# Altium schematic sheet Board AB Thumb.SchDoc
size A3
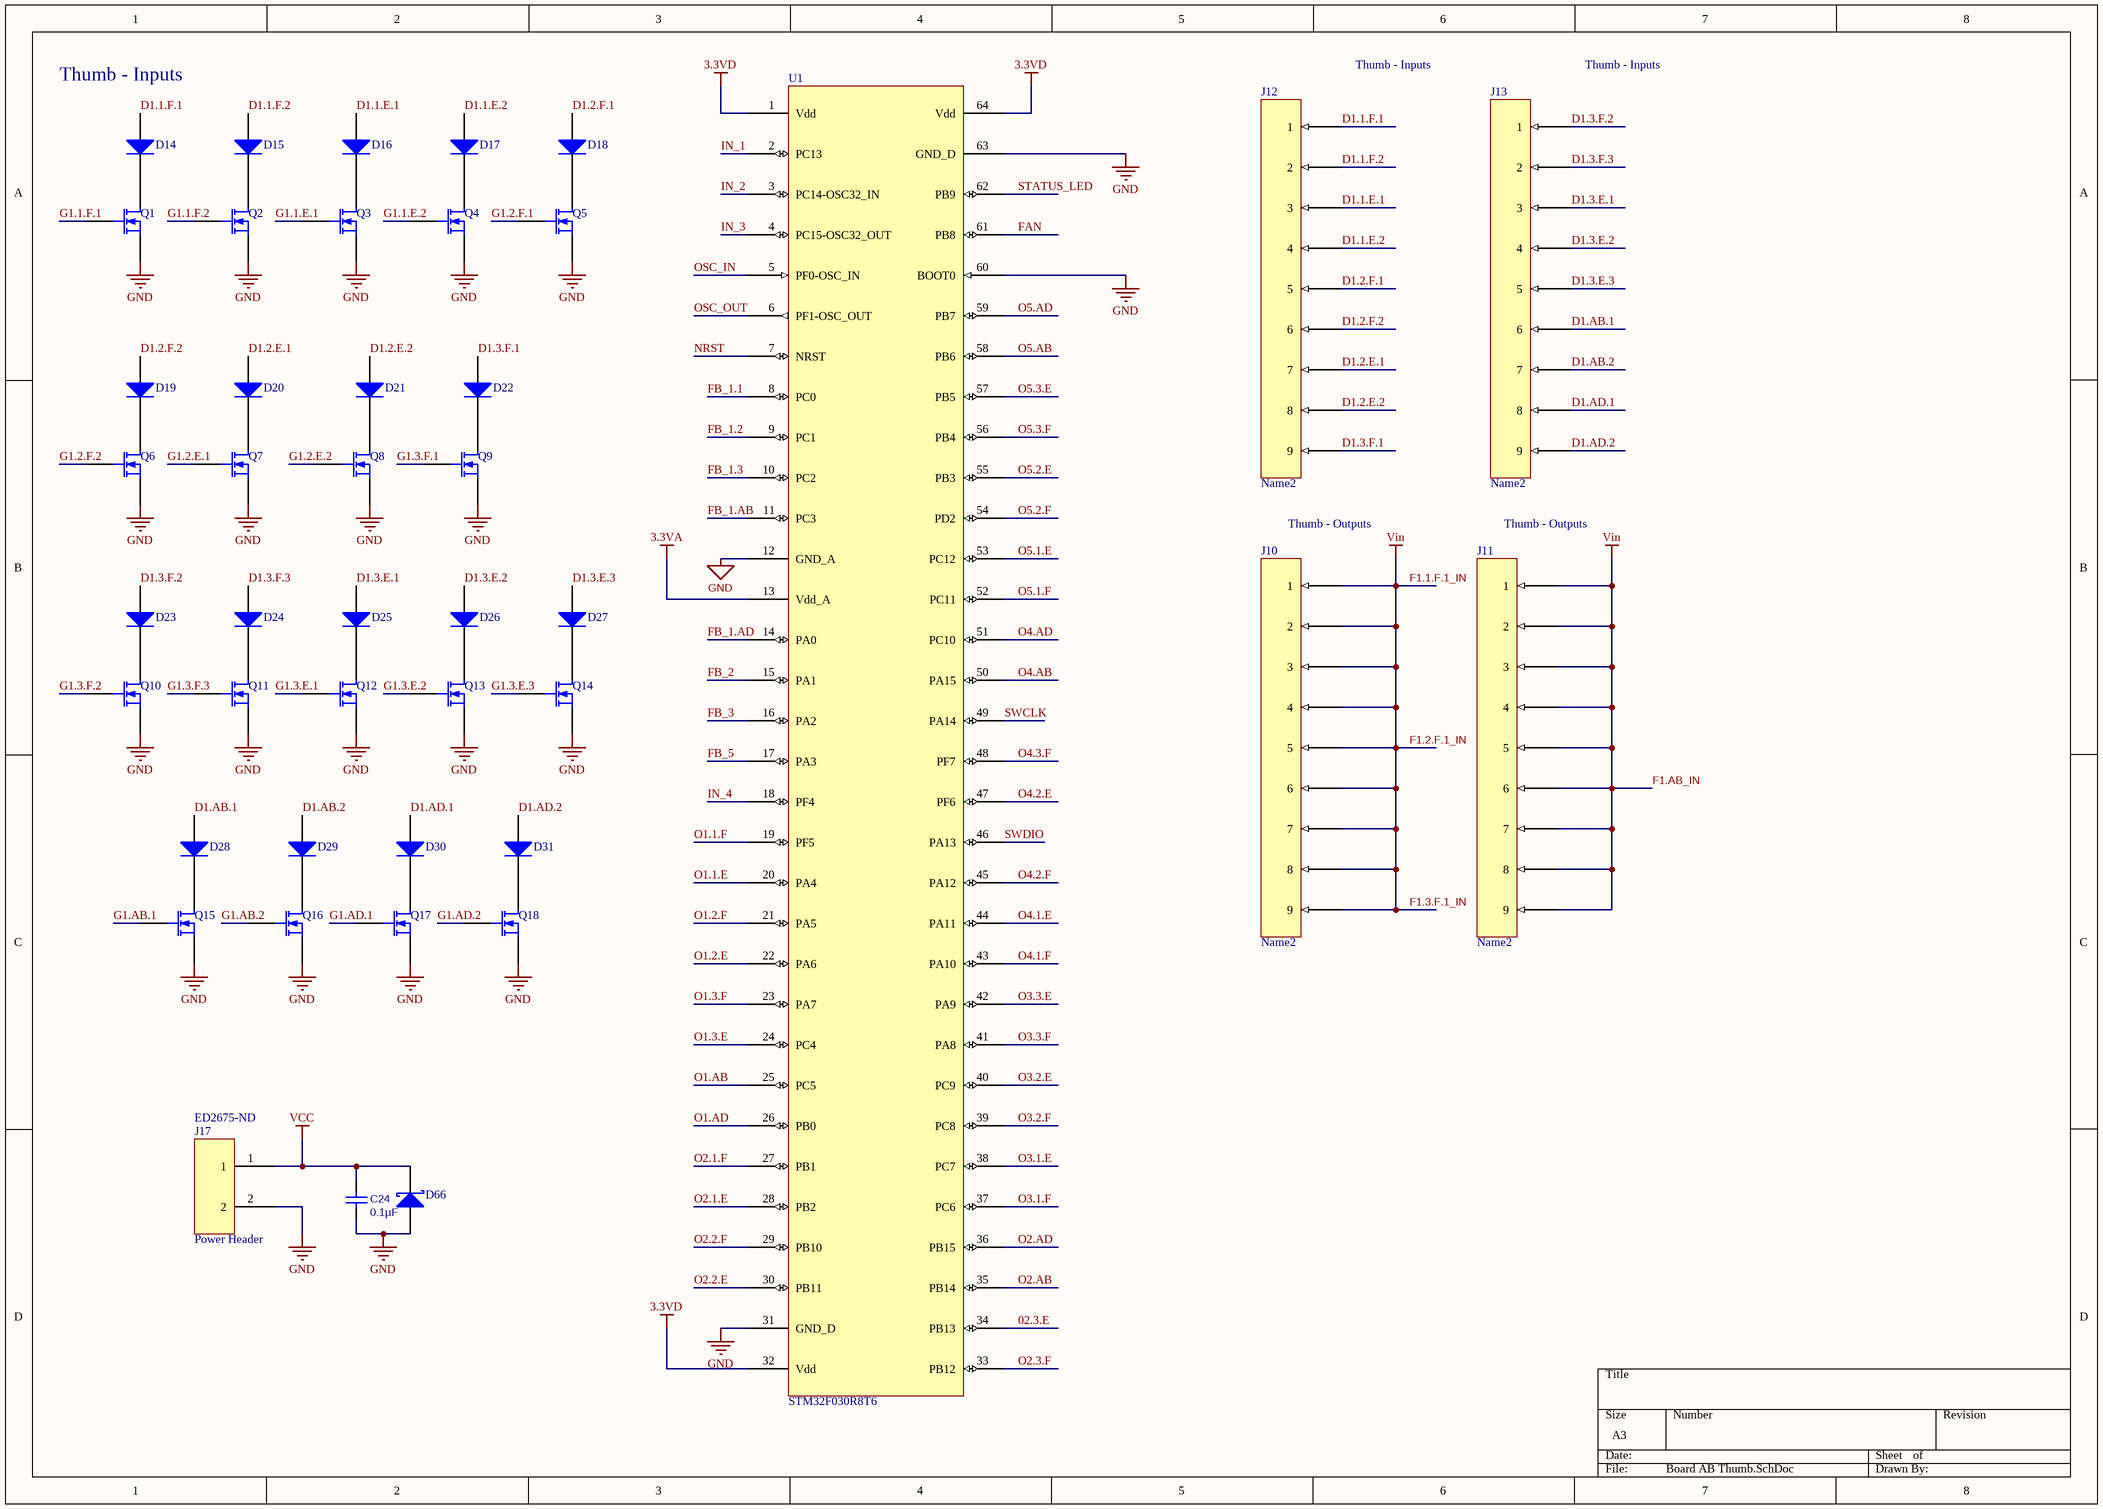
[diagram p0: Board AB Thumb.SchDoc]

## Parts
C24  value 0.1µF  [TDK C-Series (1608)]
D14  de  [SMC]  (value not drawn)
D15  de  [SMC]  (value not drawn)
D16  de  [SMC]  (value not drawn)
D17  de  [SMC]  (value not drawn)
D18  de  [SMC]  (value not drawn)
D19  de  [SMC]  (value not drawn)
D20  de  [SMC]  (value not drawn)
D21  de  [SMC]  (value not drawn)
D22  de  [SMC]  (value not drawn)
D23  de  [SMC]  (value not drawn)
D24  de  [SMC]  (value not drawn)
D25  de  [SMC]  (value not drawn)
D26  de  [SMC]  (value not drawn)
D27  de  [SMC]  (value not drawn)
D28  de  [SMC]  (value not drawn)
D29  de  [SMC]  (value not drawn)
D30  de  [SMC]  (value not drawn)
D31  de  [SMC]  (value not drawn)
D66  Diode BAT17  [SOT-23_N]  (value not drawn)
J10  Name2
J11  Name2
J12  Name2
J13  Name2
J17  Power Header  Supplier Part Number 1: ED2675-ND
Q1  (no value)
Q2  (no value)
Q3  (no value)
Q4  (no value)
Q5  (no value)
Q6  (no value)
Q7  (no value)
Q8  (no value)
Q9  (no value)
Q10  (no value)
Q11  (no value)
Q12  (no value)
Q13  (no value)
Q14  (no value)
Q15  (no value)
Q16  (no value)
Q17  (no value)
Q18  (no value)
U1  STM32F030R8T6

## Nets
3.3VA: U1.13(Vdd_A)
3.3VD: U1.1(Vdd) U1.32(Vdd) U1.64(Vdd)
F1.1.F.1_IN: J10.1 J10.3 J10.4 J10.5 J10.6 J10.7 J10.8 J10.9 J10.66(2) J11.1 J11.3 J11.4 J11.5 J11.6 J11.7 J11.8 J11.9 J11.66(2)  [also labelled F1.2.F.1_IN, F1.3.F.1_IN, F1.AB_IN, Vin]
GND: C24.1 D66.1(A) J17.2 Q1.3(S) Q2.3(S) Q3.3(S) Q4.3(S) Q5.3(S) Q6.3(S) Q7.3(S) Q8.3(S) Q9.3(S) Q10.3(S) Q11.3(S) Q12.3(S) Q13.3(S) Q14.3(S) Q15.3(S) Q16.3(S) Q17.3(S) Q18.3(S) U1.12(GND_A) U1.31(GND_D) U1.60(BOOT0) U1.63(GND_D)
VCC: C24.2 D66.3(K) J17.1
02.3.E: U1.34(PB13)
D1.1.E.1: D16.1(A) J12.3
D1.1.E.2: D17.1(A) J12.4
D1.1.F.1: D14.1(A) J12.1
D1.1.F.2: D15.1(A) J12.66(2)
D1.2.E.1: D20.1(A) J12.7
D1.2.E.2: D21.1(A) J12.8
D1.2.F.1: D18.1(A) J12.5
D1.2.F.2: D19.1(A) J12.6
D1.3.E.1: D25.1(A) J13.3
D1.3.E.2: D26.1(A) J13.4
D1.3.E.3: D27.1(A) J13.5
D1.3.F.1: D22.1(A) J12.9
D1.3.F.2: D23.1(A) J13.1
D1.3.F.3: D24.1(A) J13.66(2)
D1.AB.1: D28.1(A) J13.6
D1.AB.2: D29.1(A) J13.7
D1.AD.1: D30.1(A) J13.8
D1.AD.2: D31.1(A) J13.9
FAN: U1.61(PB8)
FB_1.1: U1.8(PC0)
FB_1.2: U1.9(PC1)
FB_1.3: U1.10(PC2)
FB_1.AB: U1.11(PC3)
FB_1.AD: U1.14(PA0)
FB_2: U1.15(PA1)
FB_3: U1.16(PA2)
FB_5: U1.17(PA3)
G1.1.E.1: Q3.2(G)
G1.1.E.2: Q4.2(G)
G1.1.F.1: Q1.2(G)
G1.1.F.2: Q2.2(G)
G1.2.E.1: Q7.2(G)
G1.2.E.2: Q8.2(G)
G1.2.F.1: Q5.2(G)
G1.2.F.2: Q6.2(G)
G1.3.E.1: Q12.2(G)
G1.3.E.2: Q13.2(G)
G1.3.E.3: Q14.2(G)
G1.3.F.1: Q9.2(G)
G1.3.F.2: Q10.2(G)
G1.3.F.3: Q11.2(G)
G1.AB.1: Q15.2(G)
G1.AB.2: Q16.2(G)
G1.AD.1: Q17.2(G)
G1.AD.2: Q18.2(G)
IN_1: U1.2(PC13)
IN_2: U1.3(PC14-OSC32_IN)
IN_3: U1.4(PC15-OSC32_OUT)
IN_4: U1.18(PF4)
NRST: U1.7(NRST)
O1.1.E: U1.20(PA4)
O1.1.F: U1.19(PF5)
O1.2.E: U1.22(PA6)
O1.2.F: U1.21(PA5)
O1.3.E: U1.24(PC4)
O1.3.F: U1.23(PA7)
O1.AB: U1.25(PC5)
O1.AD: U1.26(PB0)
O2.1.E: U1.28(PB2)
O2.1.F: U1.27(PB1)
O2.2.E: U1.30(PB11)
O2.2.F: U1.29(PB10)
O2.3.F: U1.33(PB12)
O2.AB: U1.35(PB14)
O2.AD: U1.36(PB15)
O3.1.E: U1.38(PC7)
O3.1.F: U1.37(PC6)
O3.2.E: U1.40(PC9)
O3.2.F: U1.39(PC8)
O3.3.E: U1.42(PA9)
O3.3.F: U1.41(PA8)
O4.1.E: U1.44(PA11)
O4.1.F: U1.43(PA10)
O4.2.E: U1.47(PF6)
O4.2.F: U1.45(PA12)
O4.3.F: U1.48(PF7)
O4.AB: U1.50(PA15)
O4.AD: U1.51(PC10)
O5.1.E: U1.53(PC12)
O5.1.F: U1.52(PC11)
O5.2.E: U1.55(PB3)
O5.2.F: U1.54(PD2)
O5.3.E: U1.57(PB5)
O5.3.F: U1.56(PB4)
O5.AB: U1.58(PB6)
O5.AD: U1.59(PB7)
OSC_IN: U1.5(PF0-OSC_IN)
OSC_OUT: U1.6(PF1-OSC_OUT)
STATUS_LED: U1.62(PB9)
SWCLK: U1.49(PA14)
SWDIO: U1.46(PA13)
NetD14_2: D14.2(K) Q1.1(D)
NetD15_2: D15.2(K) Q2.1(D)
NetD16_2: D16.2(K) Q3.1(D)
NetD17_2: D17.2(K) Q4.1(D)
NetD18_2: D18.2(K) Q5.1(D)
NetD19_2: D19.2(K) Q6.1(D)
NetD20_2: D20.2(K) Q7.1(D)
NetD21_2: D21.2(K) Q8.1(D)
NetD22_2: D22.2(K) Q9.1(D)
NetD23_2: D23.2(K) Q10.1(D)
NetD24_2: D24.2(K) Q11.1(D)
NetD25_2: D25.2(K) Q12.1(D)
NetD26_2: D26.2(K) Q13.1(D)
NetD27_2: D27.2(K) Q14.1(D)
NetD28_2: D28.2(K) Q15.1(D)
NetD29_2: D29.2(K) Q16.1(D)
NetD30_2: D30.2(K) Q17.1(D)
NetD31_2: D31.2(K) Q18.1(D)

## Notes on the sheet
- Thumb - Inputs
- Thumb - Outputs

## Library data of the parts
C24 = Cap: Capacitor; Published: 8-Jun-2000; LatestRevisionDate: 17-Jul-2002; LatestRevisionNote: Re-released for DXP Platform.; PackageReference: RAD-0.3; Publisher: Altium Limited; PackageDescription: Radial Cap, Thru-Hole; 2 Leads; 0.3 in Pin Spacing; Supplier 1: Digi-Key; Supplier Part Number 1: 445-1316-1-ND
D14-D31 = Diode: Default Diode; Published: 8-Jun-2000; LatestRevisionDate: 17-Jul-2002; LatestRevisionNote: Re-released for DXP Platform.; PackageVersion: Sep-1996; PackageReference: SMC; Publisher: Altium Limited; PackageDescription: DO-214-AB/SMC; 2 C-Bend Leads; Body 7.9 x 5.9 mm, inc. leads (LxW); Code_JEDEC: DO-214-AB; Supplier 1: Digi-Key; Supplier Part Number 1: 1727-5384-1-ND
D66 = Diode BAT17: Silicon RF Schottky Diode for Mixer Applications in the VHF/UHF Range; Note: Pin 2 is not connected and not drawn.; Published: 21-Mar-2003; LatestRevisionDate: 29-May-2009; LatestRevisionNote: IPC-7351 Footprint Added.; DatasheetVersion: Oct-1999; PackageVersion: Sep-2001; PackageReference: SOT-23; Publisher: Altium Limited; PackageDescription: 3-Pin SOT-23 Package 0.95 mm Pitch, 2.5 mm Lead Span; ComponentLink1Description: Manufacturer Link; ComponentLink1URL: http://www.infineon.com/; ComponentLink2Description: Datasheet; ComponentLink2URL: http://www.infineon.com/upload/Document/cmc_upload/documents/009/363/bat17series.pdf; Supplier 1: Digi-Key; Supplier Part Number 1: DF2S10FSL3MCT-ND
J10-J13 = Name2: 9 Position header
Q1-Q18 = MOSFET-N: N-Channel MOSFET; Published: 8-Jun-2000; LatestRevisionDate: 17-Jul-2002; LatestRevisionNote: Re-released for DXP Platform.; PackageVersion: 1995/1996; PackageReference: E3; Publisher: Altium Limited; PackageDescription: TO, Flat Index; 3 In-Line, Axial Leads; Body Dia. 4.6mm; Lead Dia. 0.5 mm (max); Supplier 1: Digi-Key; Supplier 2: Digi-Key; Supplier Part Number 2: 497-7462-1-ND
J17 = Power Header: Supplier 1: Digi-Key
U1 = STM32F030R8T6: Supplier 1: Digi-Key; Supplier Part Number 1: 497-14045-ND